# EAGLE design Transceiver Module Dev Board（with MCU）_V1.0 (EAGLE 9.6.2)
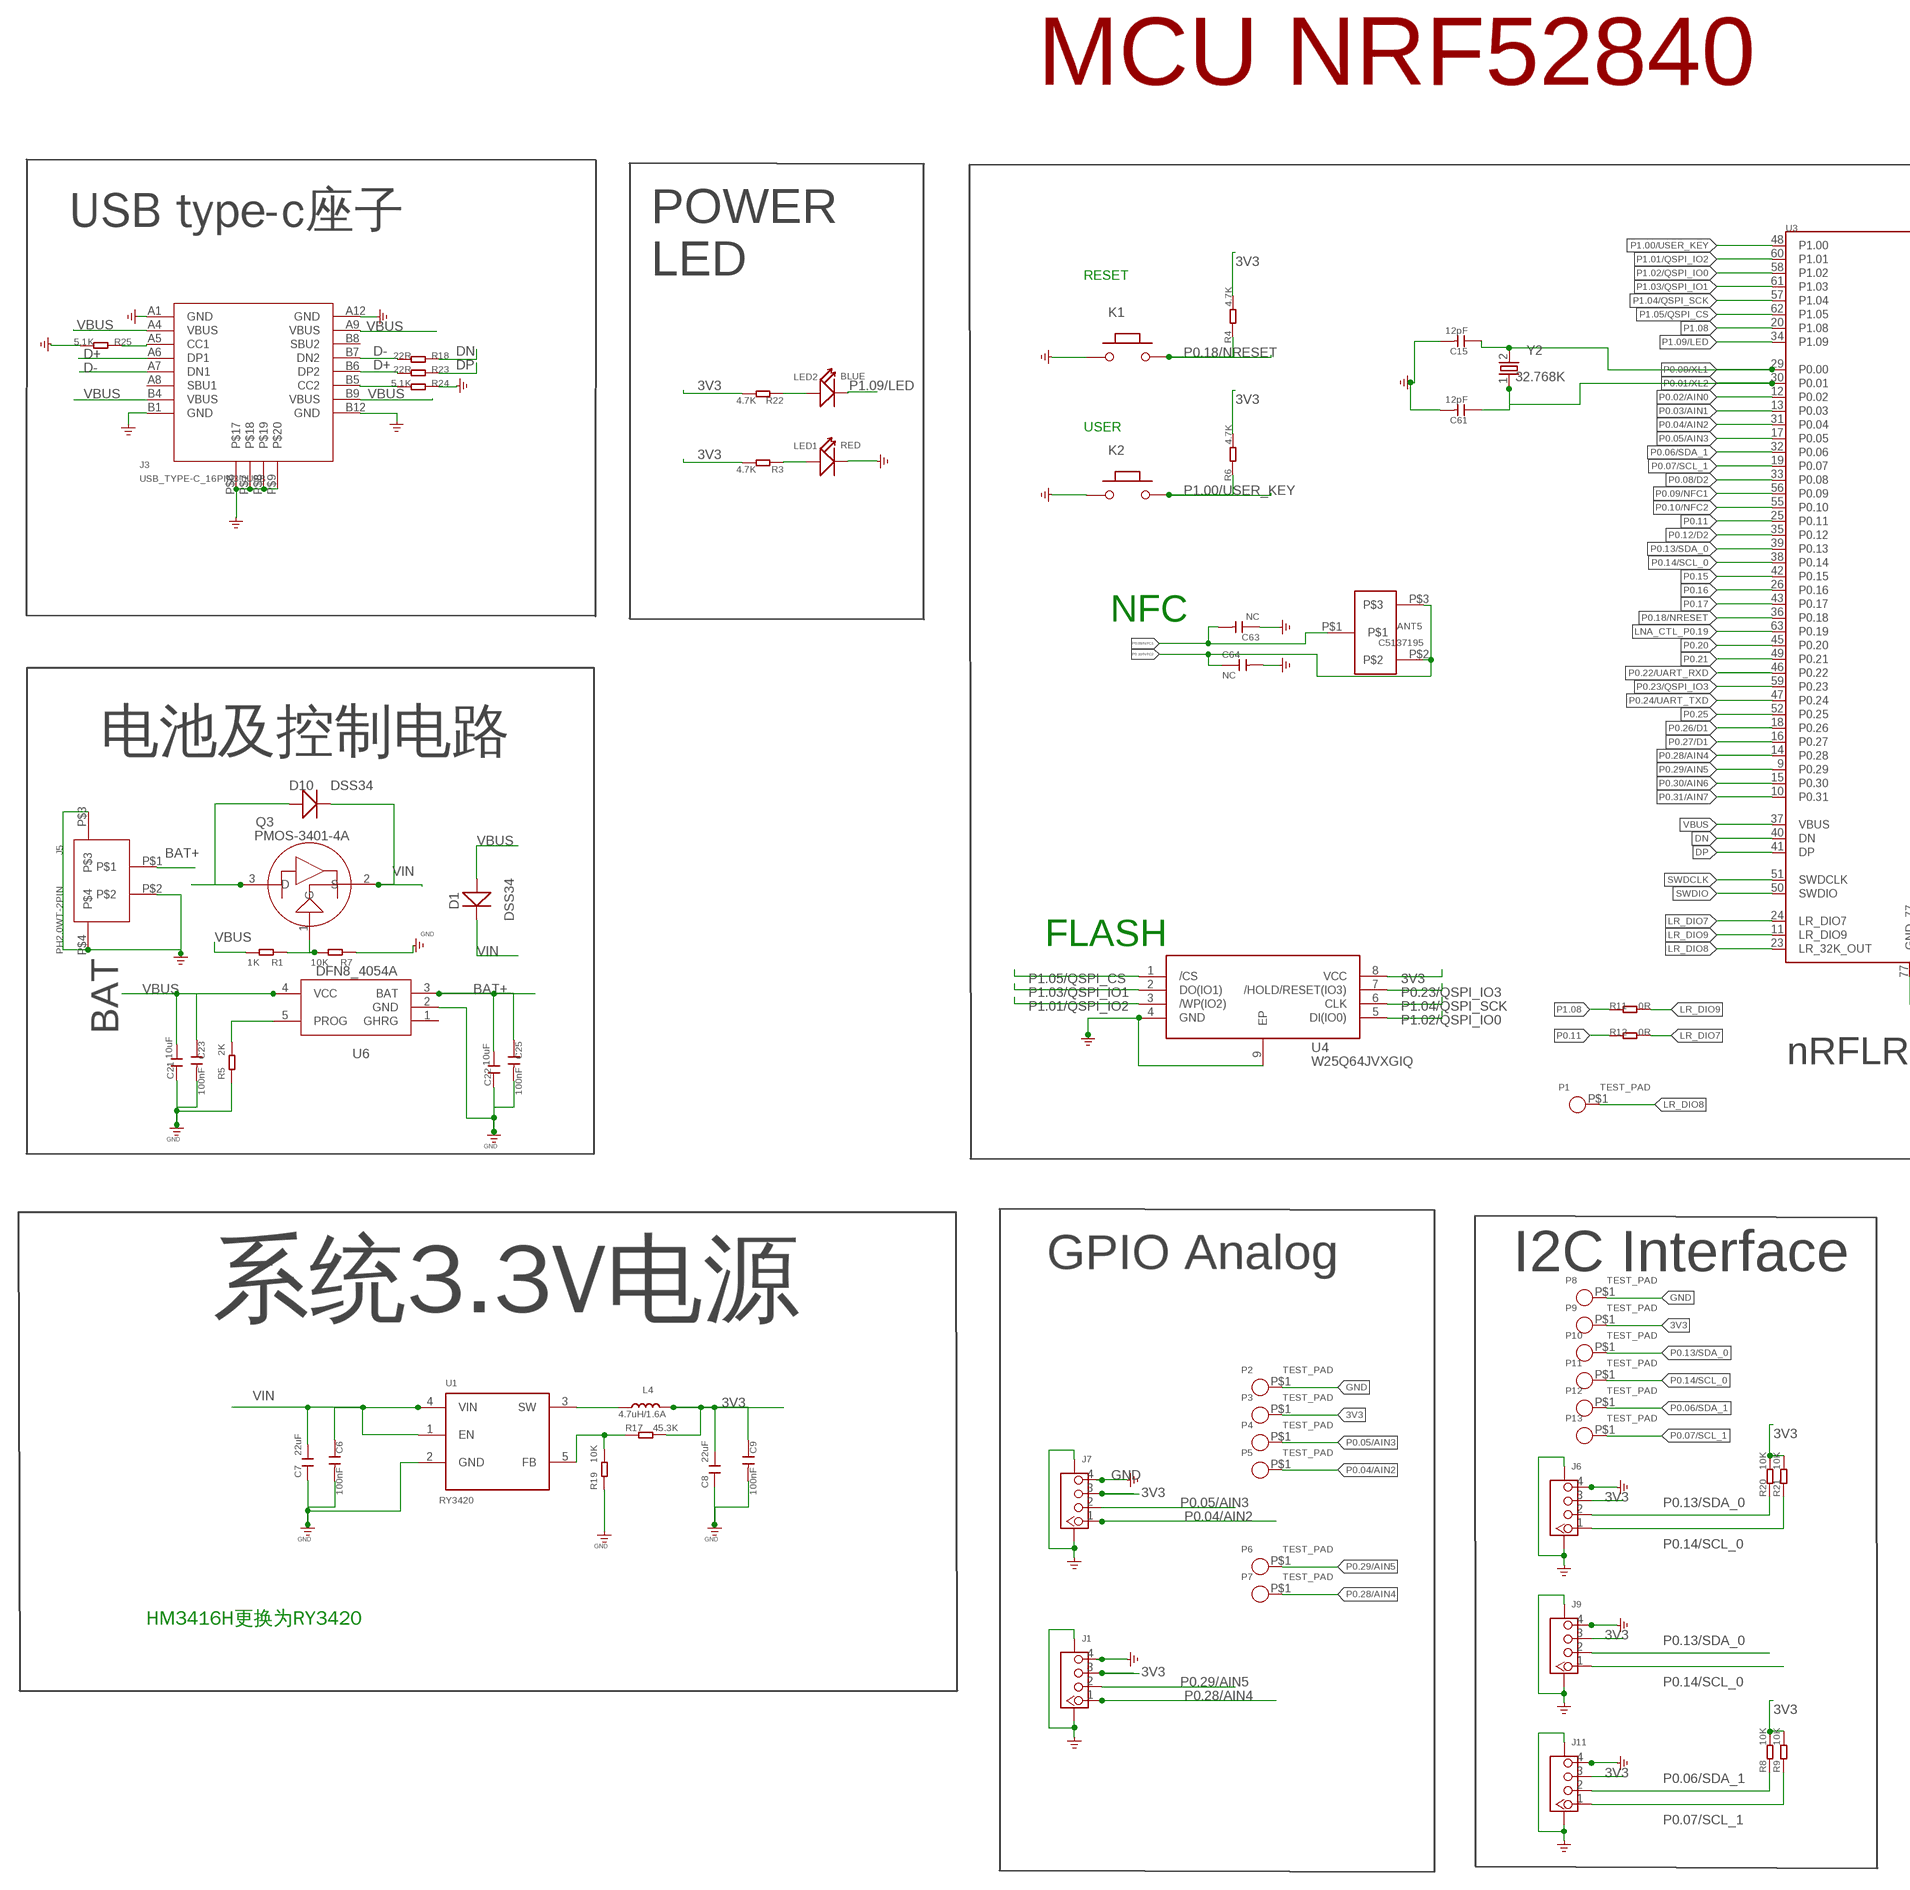
[diagram p0: schematic, sheet 1, part 1 of 2]
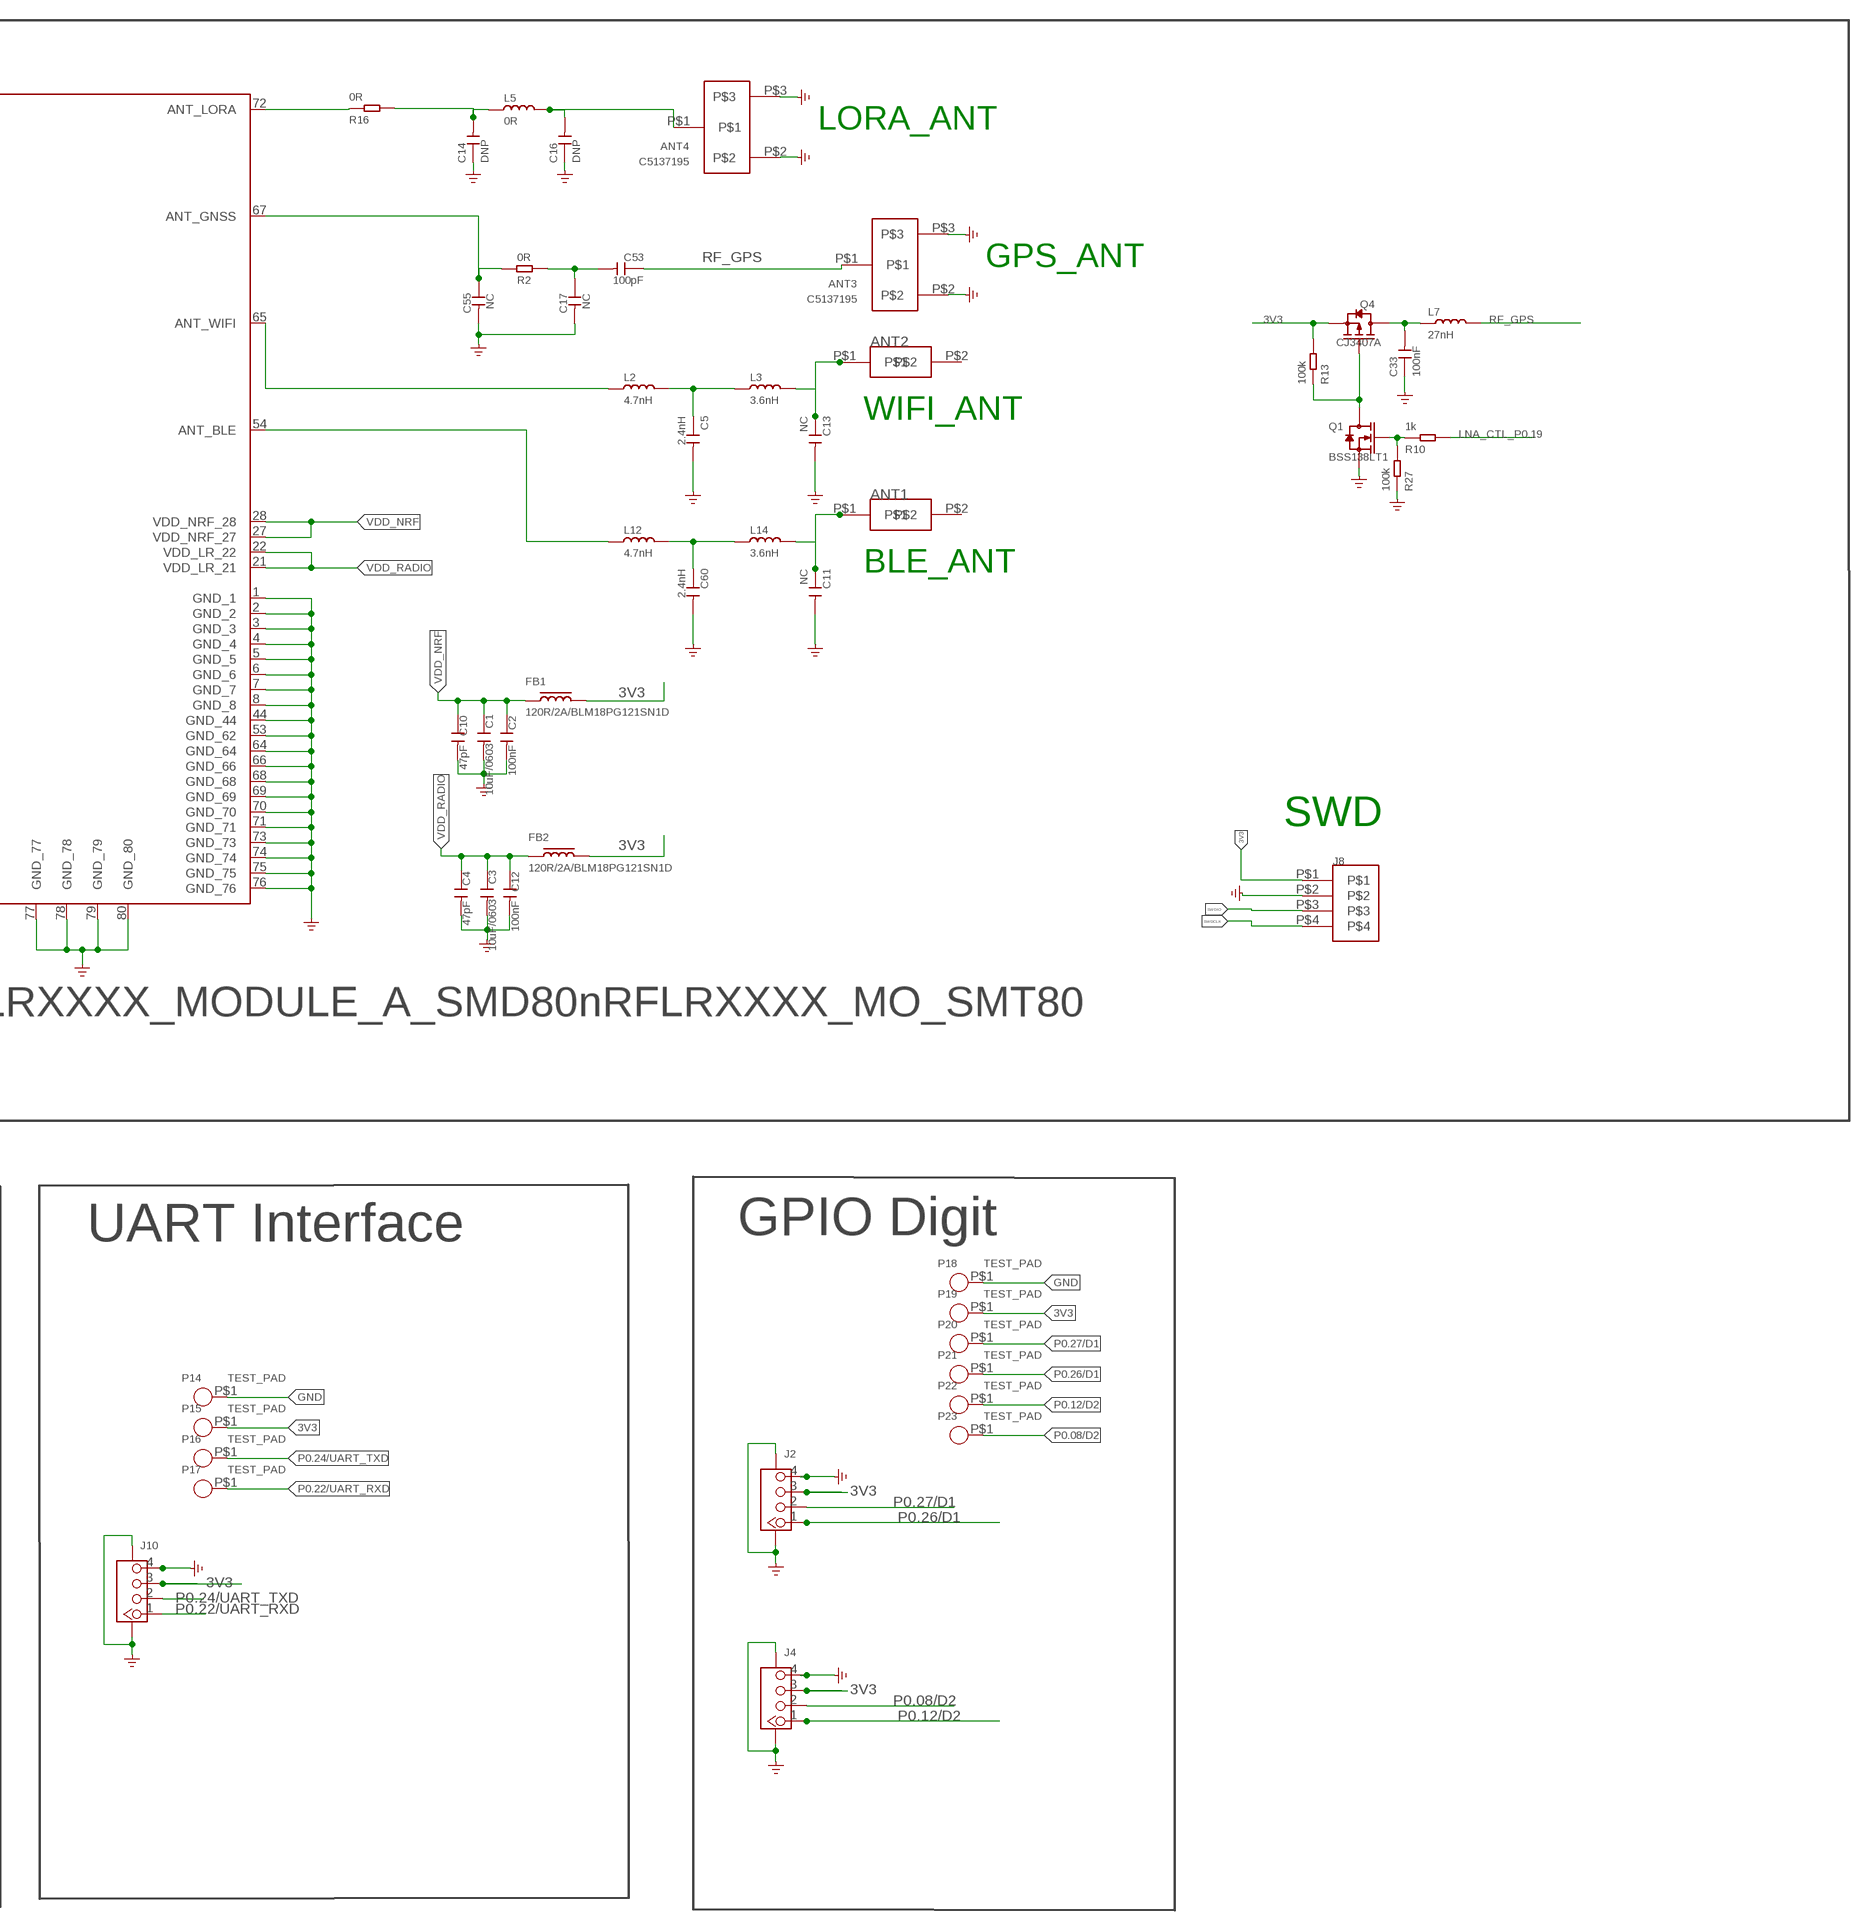
[diagram p1: schematic, sheet 1, part 2 of 2]

## Parts
ANT1  ANT2.4G_BLE  [2.4G_BLE]
ANT2  ANT2.4G_BLE  [2.4G_BLE]
ANT3  C5137195  MYSELF_IPEX  [MYSELF_IPEX1]
ANT4  C5137195  MYSELF_IPEX  [MYSELF_IPEX1]
ANT5  C5137195  MYSELF_IPEX  [MYSELF_IPEX1]
C1  10uF/0603  C0603  [C0603]
C2  100nF  CAPC0402-1  [C0402]
C3  10uF/0603  C0603  [C0603]
C4  47pF  CAPC0402-1  [C0402]
C5  2.4nH  DISCRETE-NEW_CAP-0402  [DISCRETE-NEW_C0402]
C6  100nF  CAPC0402-1  [C0402]
C7  22uF  C0603  [0603]
C8  22uF  C0603  [0603]
C9  100nF  CAPC0402-1  [C0402]
C10  47pF  CAPC0402-1  [C0402]
C11  NC  DISCRETE-NEW_CAP-0402  [DISCRETE-NEW_C0402]
C12  100nF  CAPC0402-1  [C0402]
C13  NC  DISCRETE-NEW_CAP-0402  [DISCRETE-NEW_C0402]
C14  DNP  CAP-0402  [C0402]
C15  12pF  DISCRETE-NEW_CAP-0402  [DISCRETE-NEW_C0402]
C16  DNP  CAP-0402  [C0402]
C17  NC  DISCRETE-NEW_CAP-0402  [DISCRETE-NEW_C0402]
C21  10uF  C0402_W  [0402]
C22  10uF  C0402_W  [0402]
C23  100nF  CAPC0402-1  [C0402]
C25  100nF  CAPC0402-1  [C0402]
C33  100nF  CAP-0402  [C0402]
C53  100pF  DISCRETE-NEW_CAP-0402  [DISCRETE-NEW_C0402]
C55  NC  DISCRETE-NEW_CAP-0402  [DISCRETE-NEW_C0402]
C60  2.4nH  DISCRETE-NEW_CAP-0402  [DISCRETE-NEW_C0402]
C61  12pF  DISCRETE-NEW_CAP-0402  [DISCRETE-NEW_C0402]
C63  NC  DISCRETE-NEW_CAP-0402  [DISCRETE-NEW_C0402]
C64  NC  DISCRETE-NEW_CAP-0402  [DISCRETE-NEW_C0402]
D1  DSS34  DIODE  [D_SOD123FL]
D10  DSS34  DIODE  [D_SOD123FL]
FB1  120R/2A/BLM18PG121SN1D  FBL0603  [L0603]
FB2  120R/2A/BLM18PG121SN1D  FBL0603  [L0603]
J1  CONNECTOR_TWIG-4P-2.0-SMD-FEMALE-REINFORCE90D  [CONNECTOR_4P-SMD-2.0-90D]
J2  CONNECTOR_TWIG-4P-2.0-SMD-FEMALE-REINFORCE90D  [CONNECTOR_4P-SMD-2.0-90D]
J3  USB_TYPE-C_16PIN3.0USB  [KEVIN_3.0TYPEC-SMD]
J4  CONNECTOR_TWIG-4P-2.0-SMD-FEMALE-REINFORCE90D  [CONNECTOR_4P-SMD-2.0-90D]
J5  PH2.0WT-2PIN  [PH2.0WT-2PIN]
J6  CONNECTOR_TWIG-4P-2.0-SMD-FEMALE-REINFORCE90D  [CONNECTOR_4P-SMD-2.0-90D]
J7  CONNECTOR_TWIG-4P-2.0-SMD-FEMALE-REINFORCE90D  [CONNECTOR_4P-SMD-2.0-90D]
J8  2.0MM-4P  [2.0MM-4P]
J9  CONNECTOR_TWIG-4P-2.0-SMD-FEMALE-REINFORCE90D  [CONNECTOR_4P-SMD-2.0-90D]
J10  CONNECTOR_TWIG-4P-2.0-SMD-FEMALE-REINFORCE90D  [CONNECTOR_4P-SMD-2.0-90D]
J11  CONNECTOR_TWIG-4P-2.0-SMD-FEMALE-REINFORCE90D  [CONNECTOR_4P-SMD-2.0-90D]
K1  BUTTON  PB157  [157SW]
K2  BUTTON  PB157  [157SW]
L2  4.7nH  XADOW-GPS-V2_DISCRETE-NEW_INDUCTOR/FERRITE-BEAD0402  [XADOW-GPS-V2_DISCRETE-NEW_L0402]
L3  3.6nH  XADOW-GPS-V2_DISCRETE-NEW_INDUCTOR/FERRITE-BEAD0402  [XADOW-GPS-V2_DISCRETE-NEW_L0402]
L4  4.7uH/1.6A  A9G_DISCRETE_L0805  [A9G_DISCRETE_L0805]
L5  0R  INDUCTOR'0402'  [L0402]
L7  27nH  INDUCTOR'0402'  [L0402]
L12  4.7nH  XADOW-GPS-V2_DISCRETE-NEW_INDUCTOR/FERRITE-BEAD0402  [XADOW-GPS-V2_DISCRETE-NEW_L0402]
L14  3.6nH  XADOW-GPS-V2_DISCRETE-NEW_INDUCTOR/FERRITE-BEAD0402  [XADOW-GPS-V2_DISCRETE-NEW_L0402]
LED1  RED  DISCRETE_LED0603  [DISCRETE_LED-0603]
LED2  BLUE  DISCRETE_LED0603  [DISCRETE_LED-0603]
P1  TEST_PAD  TEST_PADPAD-1.5MM  [TEST_PAD-1.5MM]
P2  TEST_PAD  TEST_PADPAD-1.5MM  [TEST_PAD-1.5MM]
P3  TEST_PAD  TEST_PADPAD-1.5MM  [TEST_PAD-1.5MM]
P4  TEST_PAD  TEST_PADPAD-1.5MM  [TEST_PAD-1.5MM]
P5  TEST_PAD  TEST_PADPAD-1.5MM  [TEST_PAD-1.5MM]
P6  TEST_PAD  TEST_PADPAD-1.5MM  [TEST_PAD-1.5MM]
P7  TEST_PAD  TEST_PADPAD-1.5MM  [TEST_PAD-1.5MM]
P8  TEST_PAD  TEST_PADPAD-1.5MM  [TEST_PAD-1.5MM]
P9  TEST_PAD  TEST_PADPAD-1.5MM  [TEST_PAD-1.5MM]
P10  TEST_PAD  TEST_PADPAD-1.5MM  [TEST_PAD-1.5MM]
P11  TEST_PAD  TEST_PADPAD-1.5MM  [TEST_PAD-1.5MM]
P12  TEST_PAD  TEST_PADPAD-1.5MM  [TEST_PAD-1.5MM]
P13  TEST_PAD  TEST_PADPAD-1.5MM  [TEST_PAD-1.5MM]
P14  TEST_PAD  TEST_PADPAD-1.5MM  [TEST_PAD-1.5MM]
P15  TEST_PAD  TEST_PADPAD-1.5MM  [TEST_PAD-1.5MM]
P16  TEST_PAD  TEST_PADPAD-1.5MM  [TEST_PAD-1.5MM]
P17  TEST_PAD  TEST_PADPAD-1.5MM  [TEST_PAD-1.5MM]
P18  TEST_PAD  TEST_PADPAD-1.5MM  [TEST_PAD-1.5MM]
P19  TEST_PAD  TEST_PADPAD-1.5MM  [TEST_PAD-1.5MM]
P20  TEST_PAD  TEST_PADPAD-1.5MM  [TEST_PAD-1.5MM]
P21  TEST_PAD  TEST_PADPAD-1.5MM  [TEST_PAD-1.5MM]
P22  TEST_PAD  TEST_PADPAD-1.5MM  [TEST_PAD-1.5MM]
P23  TEST_PAD  TEST_PADPAD-1.5MM  [TEST_PAD-1.5MM]
Q1  BSS138LT1  MOSFET-N-SI1304BDL  [SOT-323]
Q3  PMOS-3401-4A  P-MOS-SOT23  [SOT-23]
Q4  CJ3407A  MOSFET-P-SOT323  [SOT-323]
R1  1K  R0402-1  [0402]
R2  0R  DISCRETE-NEW_RES-0402  [DISCRETE-NEW_R0402]
R3  4.7K  R0402-1  [0402]
R4  4.7K  DISCRETE_R-0603  [DISCRETE_R0603]
R5  2K  R0402-1  [0402]
R6  4.7K  DISCRETE_R-0603  [DISCRETE_R0603]
R7  10K  R0402-1  [0402]
R8  10K  R0402-1  [0402]
R9  10K  R0402-1  [0402]
R10  1k  RES-0402  [R0402]
R11  0R  RES-0402  [R0402]
R12  0R  RES-0402  [R0402]
R13  100k  RES-0402  [R0402]
R16  0R  DISCRETE-NEW_RES-0402  [DISCRETE-NEW_R0402]
R17  45.3K  R0402-1  [0402]
R18  22R  R0402-1  [0402]
R19  10K  R0402-1  [0402]
R20  10K  R0402-1  [0402]
R21  10K  R0402-1  [0402]
R22  4.7K  R0402-1  [0402]
R23  22R  R0402-1  [0402]
R24  5.1K  R0402-1  [0402]
R25  5.1K  R0402-1  [0402]
R27  100k  RES-0402  [R0402]
U1  RY3420  CROWBOT_-V1.0-20220525_A_XBJ_HM3420B  [CROWBOT_-V1.0-20220525_A_XBJ_SOT23-5]
U3  nRFLRXXXX_MODULE_A_SMD80nRFLRXXXX_MO_SMT80  LR11XX_MODULE_A_SMD80LR11XX_MO_SMT80  [LR11XX_MO_A_SMD80]
U4  W25Q64JVXGIQ  [XSON-EP(4×4)]
U6  DFN8_4054A  [DFN8_SOP23-5]
Y2  32.768K  NORDIC_NRF_XTAL_32KHZ  [NORDIC_NRF_XTAL_3215_N]

## Nets
3V3: C8.2 C9.1 FB1.2 FB2.2 J1.3 J2.3 J4.3 J6.3 J7.3 J8.P$1 J9.3 J10.3 J11.3 L4.2 P3.P$1 P9.P$1 P15.P$1 P19.P$1 Q4.2(S) R3.2 R4.2 R6.2 R8.2 R9.2 R13.2 R17.2 R20.2 R21.2 R22.2 U4.8(VCC)
BAT+: C22.2 C25.1 D10.+ J5.P$1 Q3.3(D) U6.3(BAT)
D+: J3.A6(DP1) J3.B6(DP2) R23.2
D-: J3.A7(DN1) J3.B7(DN2) R18.2
DN: R18.1 U3.40(DN)
DP: R23.1 U3.41(DP)
GND: ANT3.P$2 ANT3.P$3 ANT4.P$2 ANT4.P$3 C1.2 C2.2 C3.2 C4.2 C5.2 C6.2 C7.1 C8.1 C9.2 C10.2 C11.2 C12.2 C13.2 C14.1 C15.2 C16.1 C17.2 C21.1 C22.1 C23.2 C25.2 C33.1 C55.2 C60.2 C61.2 C63.1 C64.2 J1.4 J1.SS1 J1.SS2 J2.4 J2.SS1 J2.SS2 J3.A1(GND) J3.A12(GND) J3.B1(GND) J3.B12(GND) J3.P$6 J3.P$7 J3.P$8 J3.P$9 J4.4 J4.SS1 J4.SS2 J5.P$2 J5.P$3 J5.P$4 J6.4 J6.SS1 J6.SS2 J7.4 J7.SS1 J7.SS2 J8.P$2 J9.4 J9.SS1 J9.SS2 J10.4 J10.SS1 J10.SS2 J11.4 J11.SS1 J11.SS2 K1.1 K2.1 LED1.- P2.P$1 P8.P$1 P14.P$1 P18.P$1 Q1.2(S) R5.1 R7.1 R19.1 R24.1 R25.2 R27.1 U1.2(GND) U3.1(GND_1) U3.2(GND_2) U3.3(GND_3) U3.4(GND_4) U3.5(GND_5) U3.6(GND_6) U3.7(GND_7) U3.8(GND_8) U3.44(GND_44) U3.53(GND_62) U3.64(GND_64) U3.66(GND_66) U3.68(GND_68) U3.69(GND_69) U3.70(GND_70) U3.71(GND_71) U3.73(GND_73) U3.74(GND_74) U3.75(GND_75) U3.76(GND_76) U3.77(GND_77) U3.78(GND_78) U3.79(GND_79) U3.80(GND_80) U4.4(GND) U4.9(EP) U6.2(GND) ; supply symbol labelled GND_POWER
LNA_CTL_P0.19: R10.2 U3.63(P0.19)
LR_DIO7: R12.2 U3.24(LR_DIO7)
LR_DIO8: P1.P$1 U3.23(LR_32K_OUT)
LR_DIO9: R11.2 U3.11(LR_DIO9)
N$1: LED2.+ R22.1
N$2: L12.1 U3.54(ANT_BLE)
N$3: C5.1 L2.2 L3.1
N$4: ANT2.P$1 C13.1 L3.2
N$5: L2.1 U3.65(ANT_WIFI)
N$6: J3.B5(CC2) R24.2
N$8: C55.1 R2.1 U3.67(ANT_GNSS)
N$9: R16.1 U3.72(ANT_LORA)
N$10: LED1.+ R3.1
N$11: Q3.1(G) R1.1 R7.2
N$12: J3.A5(CC1) R25.1
N$13: L4.1 U1.3(SW)
N$14: C14.2 L5.1 R16.2
N$16: ANT4.P$1 C16.2 L5.2
N$17: Q1.3(D) Q4.1(G) R13.1
N$18: Q1.1(G) R10.1 R27.2
N$20: R17.1 R19.2 U1.5(FB)
N$22: R5.2 U6.5(PROG)
N$27: C33.2 L7.1 Q4.3(D)
N$54: C17.1 C53.2 R2.2
N$63: C60.1 L12.2 L14.1
N$104: ANT1.P$1 C11.1 L14.2
P0.00/XL1: C15.1 U3.29(P0.00) Y2.2
P0.01/XL2: C61.1 U3.30(P0.01) Y2.1
P0.02/AIN0: U3.12(P0.02)
P0.03/AIN1: U3.13(P0.03)
P0.04/AIN2: J7.1 P5.P$1 U3.31(P0.04)
P0.05/AIN3: J7.2 P4.P$1 U3.17(P0.05)
P0.06/SDA_1: J11.2 P12.P$1 R8.1 U3.32(P0.06)
P0.07/SCL_1: J11.1 P13.P$1 R9.1 U3.19(P0.07)
P0.08/D2: J4.2 P23.P$1 U3.33(P0.08)
P0.09/NFC1: ANT5.P$1 C63.2 U3.56(P0.09)
P0.10/NFC2: ANT5.P$2 ANT5.P$3 C64.1 U3.55(P0.10)
P0.11: R12.1 U3.25(P0.11)
P0.12/D2: J4.1 P22.P$1 U3.35(P0.12)
P0.13/SDA_0: J6.2 J9.2 P10.P$1 R20.1 U3.39(P0.13)
P0.14/SCL_0: J6.1 J9.1 P11.P$1 R21.1 U3.38(P0.14)
P0.15: U3.42(P0.15)
P0.16: U3.26(P0.16)
P0.17: U3.43(P0.17)
P0.18/NRESET: K1.2 R4.1 U3.36(P0.18)
P0.20: U3.45(P0.20)
P0.21: U3.49(P0.21)
P0.22/UART_RXD: J10.1 P17.P$1 U3.46(P0.22)
P0.23/QSPI_IO3: U3.59(P0.23) U4.7(/HOLD/RESET(IO3))
P0.24/UART_TXD: J10.2 P16.P$1 U3.47(P0.24)
P0.25: U3.52(P0.25)
P0.26/D1: J2.1 P21.P$1 U3.18(P0.26)
P0.27/D1: J2.2 P20.P$1 U3.16(P0.27)
P0.28/AIN4: J1.1 P7.P$1 U3.14(P0.28)
P0.29/AIN5: J1.2 P6.P$1 U3.9(P0.29)
P0.30/AIN6: U3.15(P0.30)
P0.31/AIN7: U3.10(P0.31)
P1.00/USER_KEY: K2.2 R6.1 U3.48(P1.00)
P1.01/QSPI_IO2: U3.60(P1.01) U4.3(/WP(IO2))
P1.02/QSPI_IO0: U3.58(P1.02) U4.5(DI(IO0))
P1.03/QSPI_IO1: U3.61(P1.03) U4.2(DO(IO1))
P1.04/QSPI_SCK: U3.57(P1.04) U4.6(CLK)
P1.05/QSPI_CS: U3.62(P1.05) U4.1(/CS)
P1.08: R11.1 U3.20(P1.08)
P1.09/LED: LED2.- U3.34(P1.09)
RF_GPS: ANT3.P$1 C53.1 L7.2
SWDCLK: J8.P$4 U3.51(SWDCLK)
SWDIO: J8.P$3 U3.50(SWDIO)
VBUS: C21.2 C23.1 D1.+ J3.A4(VBUS) J3.A9(VBUS) J3.B4(VBUS) J3.B9(VBUS) R1.2 U3.37(VBUS) U6.4(VCC)
VDD_NRF: C1.1 C2.1 C10.1 FB1.1 U3.27(VDD_NRF_27) U3.28(VDD_NRF_28)
VDD_RADIO: C3.1 C4.1 C12.1 FB2.1 U3.21(VDD_LR_21) U3.22(VDD_LR_22)
VIN: C6.1 C7.2 D1.- D10.- Q3.2(S) U1.1(EN) U1.4(VIN)
Unconnected: ANT1.P$2 ANT2.P$2 J3.A8(SBU1) J3.B8(SBU2) U6.1(GHRG)

## Notes on the sheet
- MCU NRF52840
- USB type-c座子
- LORA_ANT
- POWER
  LED
- RESET
- GPS_ANT
- USER
- WIFI_ANT
- NFC
- BLE_ANT
- 电池及控制电路
- SWD
- FLASH
- BAT
- I2C Interface | UART Interface
- 系统3.3V电源 | GPIO Analog | GPIO Digit
- HM3416H更换为RY3420

## Library data of the parts
ANT1 ANT2 = myself:ANT
ANT3-ANT5 = NBIOT:MYSELF_IPEX
C1 C3 = Lora_Basic_Gateway_ Module:C0603
C2 C4 C6 C9 C10 C12 C23 C25 = SX1302_Module:CAP*
C5 C11 C13 C15 C17 C53 C55 C60 C61 C63 C64 = Xadow-GPS-v2:DISCRETE-NEW_CAP: Ceramic Capacitors
C7 C8 = WGH:C0603
C14 C16 C33 = Discrete-new:CAP: Ceramic Capacitors
C21 C22 = WGH:C0402_W
D1 D10 = CrowPanel_Advance_HMI:DIODE*
FB1 FB2 = LoraWAN_Gateway_Mainboard:FB*
J1 J2 J4 J6 J7 J9-J11 = A_xbj:CONNECTOR_TWIG-4P-2.0-SMD-FEMALE-REINFORCE
J3 = WZ3532R024-ESP32-V0.1-20221226:USB_TYPE-C_16PIN
J5 = cooper:PH2.0WT-2PIN
J8 = myself:2.0MM-4P
K1 K2 = MySMD:PB157
L2 L3 L12 L14 = 2401:XADOW-GPS-V2_DISCRETE-NEW_INDUCTOR/FERRITE-BEAD
L4 = ESP32-S3 4.2“ EINK V1.3:A9G_DISCRETE_L*
L5 L7 = Discrete-new:INDUCTOR
LED1 LED2 = A_xbj:DISCRETE_LED*
P1-P23 = A7670X_4G_PCIE:TEST_PAD*
Q1 = Discrete-new:MOSFET-N: IRLL014: http://www.vishay.com/docs/91319/sihll014.pdf
Q3 = DFN8:P-MOS-SOT23
Q4 = Discrete-new:MOSFET-P
R1 R3 R5 R7-R9 R17-R25 = WGH:R0402-1
R2 R16 = Xadow-GPS-v2:DISCRETE-NEW_RES
R4 R6 = Crowtail-_LED-V2.0-20190615-01:DISCRETE_R*
R10 R13 R27 = Discrete-new:RES
R11 R12 = LoraWAN_Gateway_Mainboard:RES*
U1 = CrowPanel ESP32 Display-4.3-inch-V2.1-20240314:CROWBOT_-V1.0-20220525_A_XBJ_HM3420B
U3 = LORA_LR1110:LR11XX_MODULE_A_SMD80
U4 = ESP32-S3 4.2“ EINK V1.3:W25Q64JVXGIQ
U6 = CrowPanel ESP32 Display-4.3-inch-V2.1-20240314:DFN8_4054A
Y2 = nRF52832_MCU:NORDIC_NRF_XTAL_32KHZ

## Net classes
1 50ohm: width 0.156 mm, drill 0.203 mm, clearance 0.469 mm

## Board
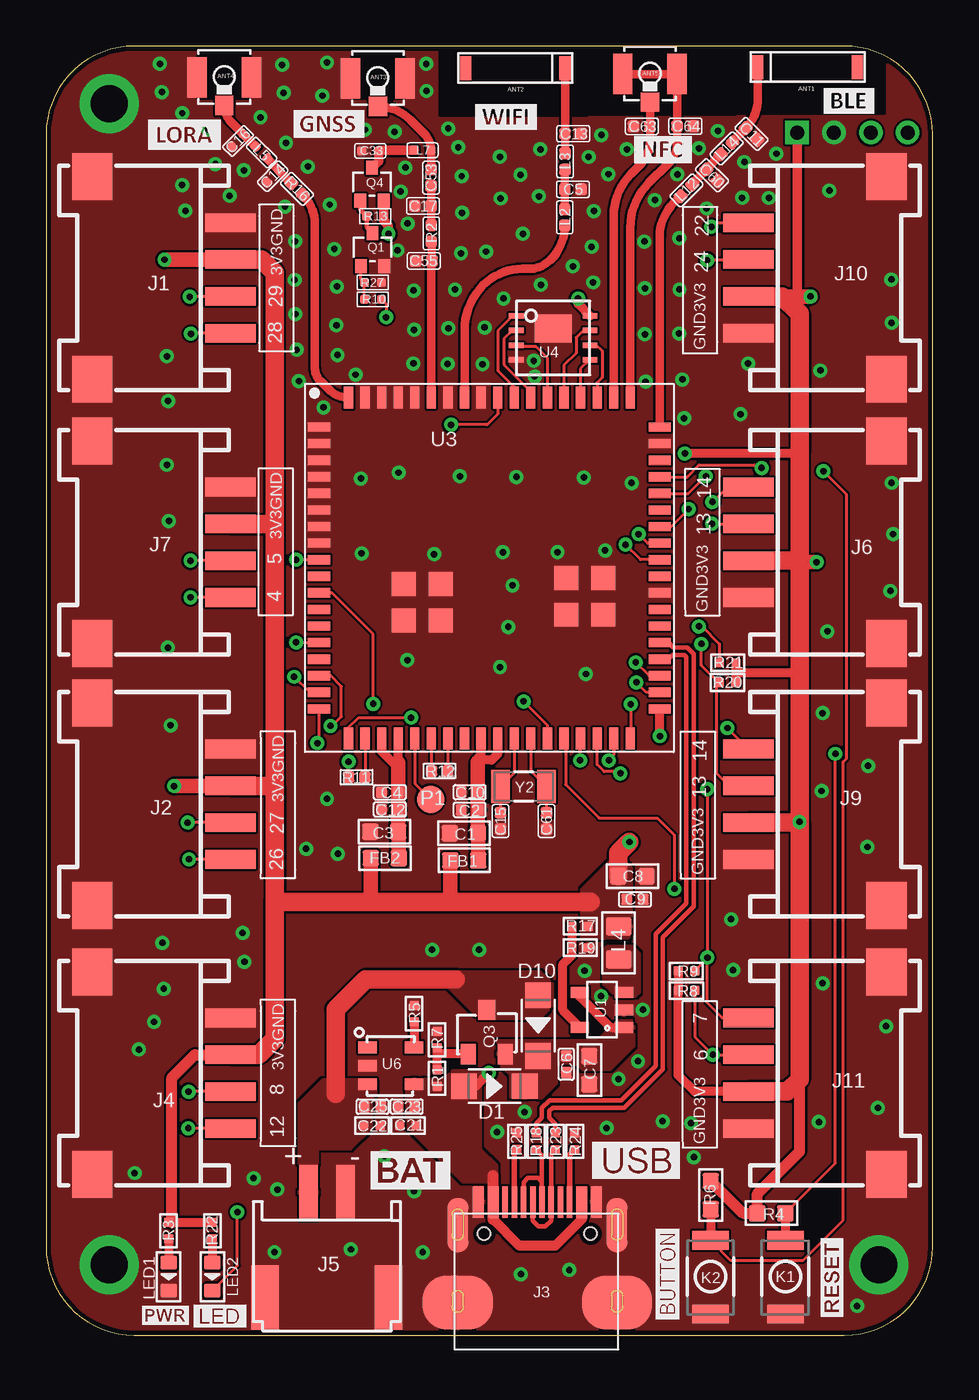
[diagram p2: board, top side]
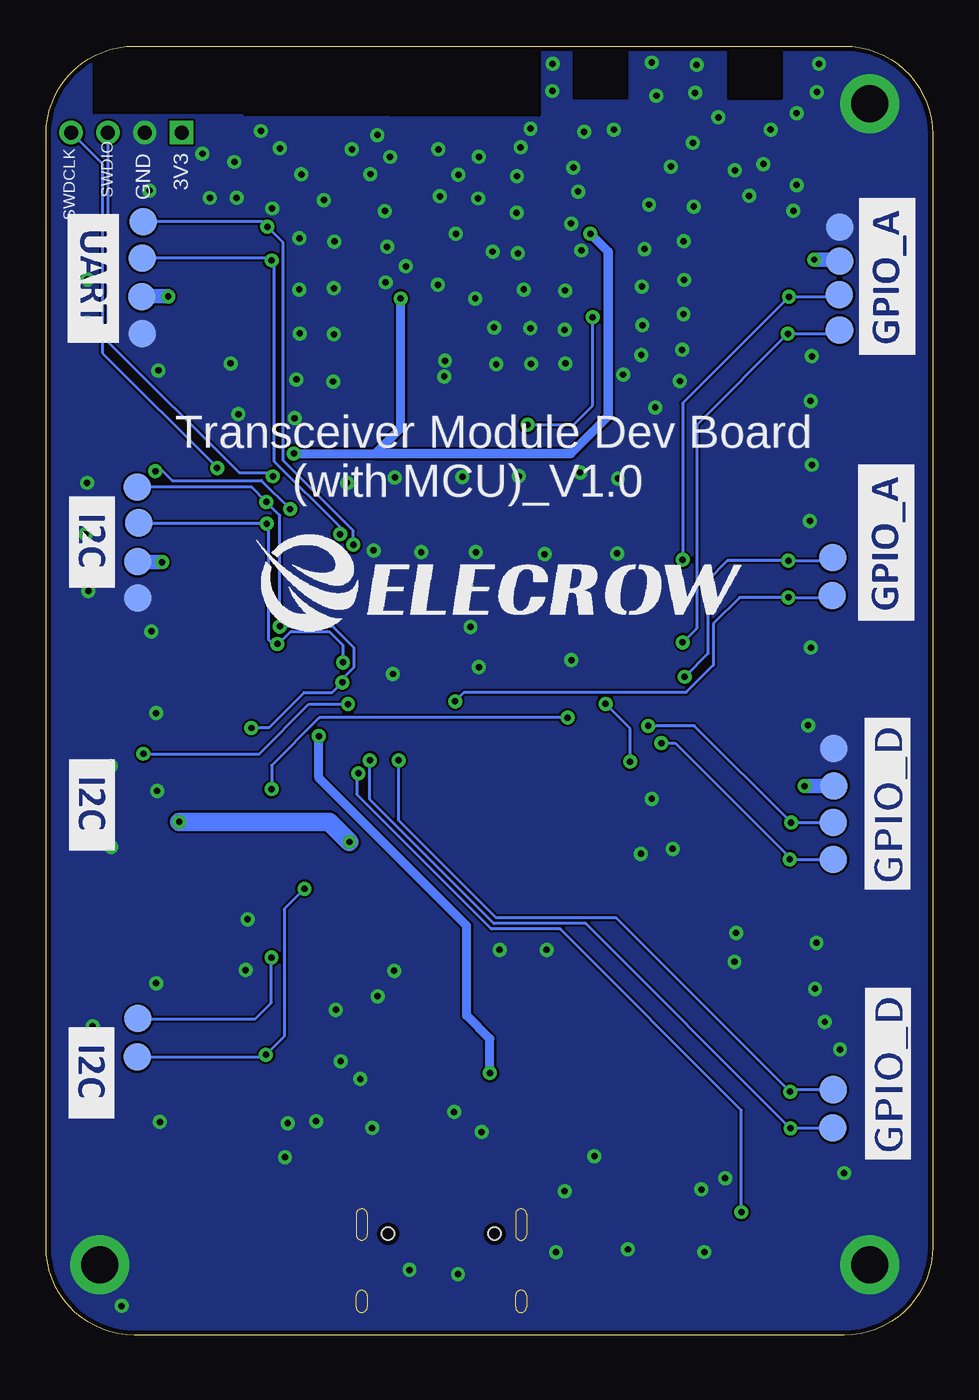
[diagram p3: board, bottom side, seen from below]

Size 48.13 x 70 mm. Coordinates in mm from the lower left corner, seen from the top.
Outline: 48.13,4.8 48.13,65.2 arc90 43.33,70 4.8,70 arc90 0,65.2 0,4.8 arc90 4.8,0 43.33,0 arc90 48.13,4.8
Copper layers (1*16): Top 0.035mm / dielectric 1.5mm / Bottom 0.035mm
Design rules "default *": minimum track width 6mil, minimum drill 0.35mm, track to track 0.12mm, track to pad 6mil, pad to pad 6mil, via to via 6mil, smd to smd 6mil, copper to edge 10mil, drill to drill 6mil, minimum pad ring 10mil, minimum via ring 8mil, stop-mask expansion 4mil, vias tented up to drill 50mil, thermal gap 0mil

### Footprints (pad centres in the part's own frame; a part is rotated, then mirrored left to right if it is on the bottom)
2.4G_BLE = smd 0.6 x 1.3: P$1 0,0; P$2 5.4,0
MYSELF_IPEX1 = smd 1.05 x 1: P$1 0,0 | smd 2.2 x 1.05: P$2 1.525,-1.475; P$3 1.525,1.475
C0603 = smd 0.889 x 0.889: 1 -0.762,0; 2 0.762,0
C0402 = smd 0.6 x 0.6: 1 -0.45,0; 2 0.45,0
DISCRETE-NEW_C0402 = smd 0.635 x 0.635: 1 0,0.445; 2 0,-0.445
0603 = smd 0.889 x 0.889: 1 -0.762,0; 2 0.762,0
C0402' = smd 0.5 x 0.5: 1 -0.463,0; 2 0.463,0
0402 = smd 0.5 x 0.5: 1 -0.45,0; 2 0.45,0
D_SOD123FL = smd 1.397 x 1.397: + -1.651,0; - 1.651,0
L0603 = smd 0.889 x 0.889: 1 -0.762,0; 2 0.762,0
CONNECTOR_4P-SMD-2.0-90D = smd 1.01 x 2.74: 1 -3,-0.1; 2 -1,-0.1; 3 1,-0.1; 4 3,-0.1 | smd 2.54 x 2.184: SS1 -5.5,7.4; SS2 5.5,7.4
KEVIN_3.0TYPEC-SMD = smd 0.3 x 1.7: A1 -3.35,0.5; A4 -2.55,0.5; A5 -1.25,0.5; A6 -0.25,0.5; A7 0.25,0.5; A8 1.25,0.5; A9 2.55,0.5; A12 3.35,0.5; B1 3.05,0.5; B4 2.25,0.5; B5 1.75,0.5; B6 0.75,0.5; B7 -0.75,0.5; B8 -1.75,0.5; B9 -2.25,0.5; B12 -3.05,0.5 | smd 1.143 x 2.921: P$6 -4.318,-0.762; P$7 4.318,-0.762 | smd 3.81 x 2.921: P$8 -4.318,-4.953; P$9 4.318,-4.953 | hole 0.68: -2.89,-1.22; 2.89,-1.22
PH2.0WT-2PIN = smd 1 x 3: P$1 -1,0; P$2 1,0 | smd 1.5 x 3.5: P$3 -3.35,-5.7; P$4 3.35,-5.7
2.0MM-4P = drill 0.762 pad 1.27 square: P$1 0,0 | drill 0.762 pad 1.27: P$2 2,0; P$3 4,0; P$4 6,0
157SW = smd 1.016 x 1.981: 1 0,0; 2 4,0
XADOW-GPS-V2_DISCRETE-NEW_L0402 = smd 0.635 x 0.635: 1 -0.445,0; 2 0.445,0
A9G_DISCRETE_L0805 = smd 1.016 x 1.397: 1 -0.889,0; 2 0.889,0
L0402 = smd 0.5 x 0.5: 1 -0.463,0; 2 0.463,0
DISCRETE_LED-0603 = smd 0.762 x 0.889: + -0.762,0; - 0.762,0
TEST_PAD-1.5MM = smd 1.5 x 1.5: P$1 0,0
SOT-323 = smd 0.762 x 0.635: 1 0.889,-0.635; 2 0.889,0.635; 3 -0.889,0
SOT-23 = smd 1.1 x 0.8: 1 1.2,-1; 2 1.2,1 | smd 1.1 x 0.9: 3 -1.2,0
DISCRETE-NEW_R0402 = smd 0.635 x 0.635: 1 0,0.445; 2 0,-0.445
DISCRETE_R0603 = smd 0.889 x 0.889: 1 -0.762,0; 2 0.762,0
R0402 = smd 0.5 x 0.5: 1 -0.463,0; 2 0.463,0
R0402' = smd 0.635 x 0.635: 1 -0.445,0; 2 0.445,0
CROWBOT_-V1.0-20220525_A_XBJ_SOT23-5 = smd 0.6 x 1: 1 -0.95,-1.2; 2 0,-1.2; 3 0.95,-1.2; 4 0.95,1.2; 5 -0.95,1.2
LR11XX_MO_A_SMD80 = smd 1.2 x 0.5: 1 -9.25,7.65; 2 -9.25,6.75; 3 -9.25,5.85; 4 -9.25,4.95; 5 -9.25,4.05; 6 -9.25,3.15; 7 -9.25,2.25; 8 -9.25,1.35; 9 -9.25,0.45; 10 -9.25,-0.45; 11 -9.25,-1.35; 12 -9.25,-2.25; 13 -9.25,-3.15; 14 -9.25,-4.05; 15 -9.25,-4.95; 16 -9.25,-5.85; 17 -9.25,-6.75; 18 -9.25,-7.65; 37 9.25,-7.65; 38 9.25,-6.75; 39 9.25,-5.85; 40 9.25,-4.95; 41 9.25,-4.05; 42 9.25,-3.15; 43 9.25,-2.25; 44 9.25,-1.35; 45 9.25,-0.45; 46 9.25,0.45; 47 9.25,1.35; 48 9.25,2.25; 49 9.25,3.15; 50 9.25,4.05; 51 9.25,4.95; 52 9.25,5.85; 53 9.25,6.75; 54 9.25,7.65 | smd 0.5 x 1.2: 19 -7.65,-9.25; 20 -6.75,-9.25; 21 -5.85,-9.25; 22 -4.95,-9.25; 23 -4.05,-9.25; 24 -3.15,-9.25; 25 -2.25,-9.25; 26 -1.35,-9.25; 27 -0.45,-9.25; 28 0.45,-9.25; 29 1.35,-9.25; 30 2.25,-9.25; 31 3.15,-9.25; 32 4.05,-9.25; 33 4.95,-9.25; 34 5.85,-9.25; 35 6.75,-9.25; 36 7.65,-9.25; 55 7.65,9.25; 56 6.75,9.25; 57 5.85,9.25; 58 4.95,9.25; 59 4.05,9.25; 60 3.15,9.25; 61 2.25,9.25; 62 1.35,9.25; 63 0.45,9.25; 64 -0.45,9.25; 65 -1.35,9.25; 66 -2.25,9.25; 67 -3.15,9.25; 68 -4.05,9.25; 69 -4.95,9.25; 70 -5.85,9.25; 71 -6.75,9.25; 72 -7.65,9.25 | smd 1.3 x 1.3: 73 -4.64,-0.86; 74 -2.64,-0.86; 75 -4.64,-2.86; 76 -2.64,-2.86; 77 4.18,-0.54; 78 6.18,-0.54; 79 4.18,-2.54; 80 6.18,-2.54
XSON-EP(4×4) = smd 0.8 x 0.3: 1 -2,1.2; 2 -2,0.4; 3 -2,-0.4; 4 -2,-1.2; 5 2,-1.2; 6 2,-0.4; 7 2,0.4; 8 2,1.2 | smd 2 x 1.5: 9 0,0.5
DFN8_SOP23-5 = smd 1 x 0.635: 1 -1.27,1; 2 -1.27,0; 3 -1.27,-1; 4 1.27,-1; 5 1.27,1
NORDIC_NRF_XTAL_3215_N = smd 1 x 1.8: 1 -1.25,0; 2 1.25,0

### Placement (x,y rotation side)
ANT1  38.64,68.86 0 top
ANT2  28.17,68.8 180 top
ANT3  18.01,66.72 90 top
ANT4  9.67,66.78 90 top
ANT5  32.78,66.95 90 top
C1  22.68,27.25 180 top
C2  22.99,28.52 180 top
C3  18.36,27.34 180 top
C4  18.66,29.47 180 top
C5  28.6,62.22 90 top
C6  28.24,14.71 270 top
C7  29.49,14.39 90 top
C8  31.83,24.92 180 top
C9  31.97,23.66 0 top
C10  22.99,29.48 180 top
C11  38.3,65.23 45 top
C12  18.66,28.54 180 top
C13  28.62,65.24 90 top
C14  DNP  [C0402']  12.31,62.93 45 top
C15  24.67,27.92 0 top
C16  DNP  [C0402']  10.42,64.84 45 top
C17  20.46,61.32 270 top
C21  19.65,11.38 0 top
C22  17.69,11.38 180 top
C23  19.57,12.41 180 top
C25  17.72,12.41 0 top
C33  100nF  [C0402']  17.6,64.31 0 top
C53  20.9,62.86 0 top
C55  20.51,58.33 270 top
C60  36.15,62.98 45 top
C61  27.17,27.92 0 top
C63  32.34,65.64 90 top
C64  34.7,65.65 90 top
D1  24.34,13.52 0 top
D10  26.71,16.81 270 top
FB1  22.7,25.78 180 top
FB2  18.39,25.9 180 top
J1  9.91,57.4 90 top
J2  9.91,28.83 90 top
J3  26.67,6.73 0 top
J4  9.91,14.22 90 top
J5  15.24,7.75 0 top
J6  38.22,43.05 270 top
J7  9.91,43.05 90 top
J8  40.77,65.3 0 top
J9  38.22,28.83 270 top
J10  38.22,57.4 270 top
J11  38.22,14.22 270 top
K1  40.13,1.14 90 top
K2  36.07,1.14 90 top
L2  28.16,60.7 90 top
L3  28.18,63.73 90 top
L4  31.08,21.3 90 top
L5  11.7,64.22 135 top
L7  20.44,64.34 0 top
L12  34.76,62.16 45 top
L14  36.94,64.44 45 top
LED1  6.66,3.17 270 top
LED2  9.03,3.17 270 top
P1  20.88,29.09 0 top
P2  5.05,60.16 0 bottom
P3  5.05,58.32 0 bottom
P4  5.44,42.21 0 bottom
P5  5.46,40.15 0 bottom
P6  5.07,56.49 0 bottom
P7  5.06,54.57 0 bottom
P8  43.14,40.02 0 bottom
P9  43.14,42 0 bottom
P10  43.1,44.11 0 bottom
P11  43.19,46.04 0 bottom
P12  43.18,15.11 0 bottom
P13  43.14,17.19 0 bottom
P14  42.91,54.39 0 bottom
P15  42.93,56.38 0 bottom
P16  42.91,58.49 0 bottom
P17  42.86,60.46 0 bottom
P18  5.37,31.85 0 bottom
P19  5.37,29.82 0 bottom
P20  5.4,27.85 0 bottom
P21  5.39,25.84 0 bottom
P22  5.42,11.26 0 bottom
P23  5.4,13.33 0 bottom
Q1  17.72,58.95 270 top
Q3  23.92,16.46 270 top
Q4  17.69,62.5 270 top
R1  21.23,13.95 270 top
R2  20.91,59.83 180 top
R3  6.66,5.67 90 top
R4  39.37,6.62 180 top
R5  19.98,17.46 270 top
R6  36.08,7.6 90 top
R7  21.23,16.04 270 top
R8  34.76,18.71 180 top
R9  34.76,19.77 180 top
R10  17.74,56.25 0 top
R11  0R  [R0402']  16.86,30.29 180 top
R12  0R  [R0402']  21.36,30.63 180 top
R13  17.86,60.76 0 top
R16  13.62,62.24 225 top
R17  28.99,22.2 0 top
R18  26.61,10.52 270 top
R19  28.99,21.04 180 top
R20  36.99,35.44 0 top
R21  37,36.51 0 top
R22  9.03,5.67 90 top
R23  27.65,10.52 270 top
R24  28.7,10.52 270 top
R25  25.55,10.53 90 top
R27  17.74,57.17 180 top
U1  30.17,17.67 90 top
U3  24.07,41.66 0 top
U4  27.53,54.16 0 top
U6  18.71,14.63 0 top
Y2  25.92,29.79 180 top

### Tracks (layer width: path | path; a pad name or v marks a point on that pad's centre or on a via)
3V3  (via drill 0.35)
  Top 0.5: R3.2 6.83,6.12 R22.2 | J11.3 35.21,13.22 34.31,14.12 R8.2 R9.2 | U4.8 28.88,56 v28.88,56.29 | R21.2 37.45,35.94 | 37.45,35.94 R20.2 | 37.45,35.94 37.5,35.99 40.9,35.99 | 40.9,47.92 40.86,47.88 v34.67,47.88
  Top 0.508: J8.P$1 40.77,56.4 40.54,56.4 | v18.59,59.8 18.59,60.25 18.32,60.51 R13.2 Q4.2
  Top 0.6: 6.83,6.12 6.83,13.97 8.08,15.22 J4.3 | R6.2 37.82,6.62 R4.2 38.61,7.68 40.9,9.97 40.9,13.89
  Top 0.8: FB2.2 17.63,23.54 17.61,23.52 | FB1.2 21.94,23.57 21.99,23.52 | J1.3 v6.43,58.4 | J2.3 6.97,29.83 v6.95,29.81 | 40.9,41.98 v41.82,41.98 v41.83,41.97 | J10.3 40.54,56.4 v41.49,56.4 v41.5,56.4
  Top 1: J4.3 11.54,15.22 12.41,16.09 12.41,23.53 | 12.41,29.79 12.41,23.53 | 12.41,29.79 12.41,44.01 | 12.41,44.01 12.41,57.69 11.7,58.4 J1.3 | J7.3 12.37,44.05 12.41,44.01 | J2.3 12.37,29.83 12.41,29.79 | 12.41,23.53 12.42,23.52 17.61,23.52 21.99,23.52 29.57,23.52 | C8.2 31.07,26.19 v31.66,26.78 | v40.9,27.87 40.9,13.89 40.23,13.22 J11.3 | v40.9,27.87 40.9,35.99 40.9,41.98 | 40.9,41.98 40.9,47.92 40.9,55.46 39.96,56.4 J10.3 | J9.3 40.86,27.83 v40.9,27.87 | J6.3 40.83,42.05 40.9,41.98
  Bottom 0.5: v34.67,47.88 30.25,47.88 28.88,49.25 v28.88,56.29
  Bottom 0.508: 30.25,47.88 19.65,47.88 17.61,49.92 17.61,58.82 v18.59,59.8
  Bottom 0.8: v6.43,58.4 5.13,58.4 P3.P$1 | v6.95,29.81 5.38,29.81 P19.P$1 | v41.83,41.97 v41.84,41.98 43.12,41.98 P9.P$1 | P15.P$1 42.9,56.41 v41.5,56.41 v41.5,56.4
  Bottom 1: v31.66,26.78 32.75,27.87 v40.9,27.87
  pour Top: 31.79,21.72 31.79,25.38 31.48,25.69 30.55,25.69 29.05,24.19 29.05,21.57 31.64,21.57
BAT+
  Top 1: 22.25,19.33 17.36,19.33 15.72,17.69 15.72,13.1
  pour Top: 13.75,6.3 13.75,12.61 15.02,13.88 17.91,13.88 17.91,13.09 17.64,12.82 17.64,11.2 16.52,10.08 14.71,10.08 14.71,6.3
  pour Top: 27.46,17.84 26.8,17.18 23.53,17.18 21.8,18.91 21.54,18.91 21.54,19.76 26.82,19.76 27.46,19.11
D+
  Top 0.254: J3.A6 26.42,6.2 26.72,5.9 27.1,5.9 27.42,6.22 J3.B6 27.42,9.84 R23.2
D-
  Top 0.254: J3.B7 25.92,8.3 26.15,8.53 26.72,8.53 26.92,8.33 | 26.92,8.33 J3.A7 | 26.92,8.33 26.92,9.76 R18.2
DN
  Top 0.254: R18.1 26.61,11.5 26.9,11.79 26.9,12.33 27.33,12.76 31.23,12.76 33.09,14.62 33.09,21.78 34.76,23.45 34.76,36.82 34.64,36.94 34.02,36.94 33.78,36.71 U3.40
DP
  Top 0.254: R23.1 27.65,11.46 27.32,11.79 27.32,12.18 27.5,12.35 31.4,12.35 33.48,14.44 33.48,21.6 35.17,23.29 35.17,36.98 34.81,37.34 34.06,37.34 33.79,37.61 U3.41
GND  (via drill 0.35, 2 pad 3.2)
  other vias: 10.67,21.84 10.76,20.27 26.47,52.91 26.52,52.06 7.39,66.35 9.19,63.59 15,67.3 7.56,61.05 8.8,65.46 10.74,63.25 13.02,64.74 7.38,62.45 15.79,56.94 11.64,66.12 15.82,53.22 12.89,67.46 15.4,61.39 15.64,58.97 14.22,63.46 13.52,59.4 13.53,55.44 13.5,57.3 13.61,53.5 15.06,50.37 19.14,46.84 13.73,51.81 19.63,60.36 19.25,62.1 19.08,58.9 19.96,56.73 16.8,52.16 19.98,54.59 15.76,54.84 19.94,52.76 17.3,65.46 18.92,65.34 19.5,63.4 21.8,52.74 22.57,62.93 23.89,58.83 30.52,63.04 25.88,59.81 22.52,58.75 22.58,60.95 25.75,63.01 26.83,64.39 26.75,61.84 22.2,56.78 21.84,54.67 23.69,52.72 23.81,54.71 29.7,57.16 24.83,56.29 28.6,58.04 37.69,50 42.52,62.15 36.47,65.39 35.44,64.45 24.68,61.73 32.51,56.85 32.51,54.35 32.55,51.78 34.64,49.79 34.36,54.39 34.54,51.9 34.39,56.78 32.48,59.39 34.38,59.56 35.86,61.18 37.78,61.76 37.91,63.71 39.65,64.16 39.24,61.75 45.88,57.32 45.9,54.97 38.11,52.76 42.03,52.38 6.56,53.16 6.63,50.73 6.56,47.26 6.67,44.21 6.61,37.33 6.76,33.11 6.31,21.3 6.39,18.81 5.86,17.01 5.03,15.51 4.81,8.8 20.45,4.51 12.55,7.91 12.4,4.51 11.27,8.52 16.55,4.66 18.36,9.71 19.98,7.82 25.77,3.31 28.4,3.54 33.47,11.61 30.43,11.25 35.01,11.51 35.16,9.66 44.03,1.59 41.95,11.57 45.15,12.34 45.6,16.77 42.15,19.11 20.96,20.92 23.51,20.92 37.3,19.83 37.19,22.58 15.84,26.14 14.12,26.41 15.25,29.12 44.58,26.51 42.1,29.55 44.62,30.91 42.15,33.78 42.41,38.21 45.83,40.41 45.98,43.5 45.9,46.28 24.64,36.27 19.61,36.65 29.3,35.9 25.09,38.46 17.13,42.45 21.07,42.4 25.32,40.71 24.8,42.51 27.76,42.52 30.35,42.61 17.08,46.52 22.46,46.64 25.53,46.61 29.19,46.58 31.78,46.27 30.15,65.17 29.46,63.98 31.53,64.39 29.73,61.04 26.86,57.04 29.62,59.1 33.05,61.63 34.27,63.03 24.64,63.98 9.97,61.87 6.17,69.03 6.28,67.49 12.97,61.29 12.81,68.97 15.25,69.11 20.64,69.04 20.65,67.56 21.83,65.51 22.37,64.5 25.98,12.12 24.48,11.03 29.24,19.78 30.13,18.4 32.4,17.67 32.13,14.87 31.07,13.91 3.43,66.87 3.43,3.81 45.21,3.81
  pour Top (rank 2): -6.51,72.28 -6.51,-3.76 50.66,-3.76 50.66,72.28
  pour Bottom (rank 2): -6.49,72.45 -6.49,-3.73 50.73,-3.73 50.73,72.45
  cutout Top: 21.37,70.14 21.37,66.25 29.38,66.25 29.38,70.17 21.36,70.17 21.36,70.13
  cutout Bottom: 29.37,70.16 29.37,66.27 37.34,66.27 37.34,70.16
GND1
  cutout Bottom: 37.33,70.15 37.33,66.38 45.53,66.38 45.53,70.17 37.32,70.17
GND2
  cutout Top: 37.3,70.17 37.3,66.34 45.53,66.34 45.53,70.17
GND3
  cutout Bottom: 21.36,70.17 21.36,66.24 29.38,66.24 29.38,70.17
GND4
  cutout Top: 29.32,70.14 29.32,66.3 37.45,66.3 37.45,70.14
GND5
  cutout Bottom: 8.23,69.98 8.23,67.15 11.08,67.15 11.08,69.98
GND6
  cutout Top: 8.23,70 8.23,67.16 11.08,67.16 11.08,70
GND8
  cutout Bottom: 16.6,69.99 16.6,67.16 19.45,67.16 19.45,69.99
GND9
  cutout Top: 16.6,70 16.6,67.16 19.45,67.16 19.45,70
LNA_CTL_P0.19  (via drill 0.35)
  Top 0.152: U3.63 24.52,50.02 23.94,49.44 v21.99,49.44 | R10.2 18.46,56 v18.46,55.27
  Bottom 0.152: v21.99,49.44 19.49,49.44 18.46,50.48 v18.46,55.27
LR_DIO7
  Top 0.152: U3.24 R12.2
LR_DIO8
  Top 0.152: U3.23 20.02,29.95 P1.P$1
LR_DIO9  (via drill 0.35)
  Top 0.152: R11.2 v16.42,31.14 | v17.76,34.28 17.76,38.07 15.52,40.31 U3.11
  Bottom 0.152: v16.42,31.14 16.42,32.94 v17.76,34.28
N$1
  Top 0.5: R22.1 LED2.+
N$2
  Top 0.463: U3.54 33.31,59.66 arc-45 34.06,61.46 L12.1
N$3
  Top 0.156: C5.1 arc45 C5.1 | 28.15,63.23 arc-45 L3.1
  Top 0.463: L2.2 C5.1 | C5.1 28.15,63.23
N$4
  Top 0.156: C13.1 arc45 C13.1
  Top 0.463: L3.2 C13.1 | ANT2.P$1 C13.1
N$5
  Top 0.463: L2.1 arc-45 27.39,58.41 27.37,58.38 arc-45 26.2,57.9 25.84,57.9 arc45 23.75,57.03 arc45 22.71,54.54 U3.65
N$6
  Top 0.3: R24.2 28.42,9.79 J3.B5
N$8
  Top 0.152: 20.93,59.32 arc-45 R2.1
  Top 0.463: 20.93,59.32 20.93,58.35 | C55.1 20.93,58.35 | U3.67 20.91,58.3 arc-45 20.93,58.35
N$9
  Top 0.463: U3.72 arc-45 15.36,51.34 14.9,51.8 arc-45 14.59,52.57 14.59,60.37 arc45 R16.1
N$10
  Top 0.5: R3.1 LED1.+
N$11
  Top 0.5: R1.1 21.23,15.28 | 21.23,15.28 R7.2 | Q3.1 21.25,15.26 21.23,15.28
N$12
  Top 0.3: R25.1 25.42,9.95 J3.A5
N$13
  pour Top: 30.24,20.9 30.24,19.07 30.9,18.41 32.02,18.41 32.22,18.61 32.22,20.73 31.85,21.1 30.44,21.1
N$14
  Top 0.463: R16.2 12.65,63.22 arc-45 C14.2 12.05,63.84 arc-45 L5.1
N$16
  Top 0.463: L5.2 C16.2 arc45 C16.2 10.05,65.86 arc-45 ANT4.P$1
N$17
  Top 0.254: Q1.3 17.4,60.16 R13.1 17.06,61.1 Q4.1
N$18
  Top 0.152: R10.1 R27.2 17.09,57.35 Q1.1
N$20
  Top 0.5: R17.1 R19.2 28.54,20.63 28.05,20.14 28.05,17.64 U1.5
N$22
  Top 0.5: R5.2 U6.5
N$27
  Top 0.508: Q4.3 18.07,63.76 C33.2 18.09,64.34 L7.1
N$54
  Top 0.463: R2.2 C17.1 C53.2
N$63
  Top 0.156: 35.86,63.35 arc45 C60.1 | 35.12,62.58 arc45 L12.2
  Top 0.463: L14.1 35.86,63.35 | C60.1 35.12,62.58
N$104
  Top 0.156: L14.2 arc-45 37.31,64.87
  Top 0.463: 37.31,64.87 C11.1 arc45 38.64,67.13 ANT1.P$1
P0.00/XL1
  Top 0.152: U3.29 25.41,30.54 24.75,29.88 Y2.2 C15.1
P0.01/XL2
  Top 0.152: U3.30 26.32,30.64 27.07,29.89 Y2.1 C61.1
P0.04/AIN2  (via drill 0.35)
  Top 0.152: J7.1 v7.85,40.05 v7.84,40.06 | v25.92,34.42 27.21,33.12 U3.31
  Bottom 0.152: v25.92,34.42 25.42,34.92 13.37,34.92 11.9,36.38 11.9,38.64 10.48,40.06 v7.84,40.06 5.55,40.06 P5.P$1
P0.05/AIN3  (via drill 0.35)
  Top 0.152: J7.2 v7.84,42.05 | U3.17 14.31,34.91 v13.47,35.75
  Bottom 0.152: v13.47,35.75 12.21,37.01 12.21,40.98 11.14,42.05 v7.84,42.05 5.6,42.05 P4.P$1
P0.06/SDA_1  (via drill 0.35)
  Top 0.152: R8.1 35.21,16.21 v36.2,15.22 J11.2 | U3.32 28.2,32.32 28.2,29.89 30.02,28.07 33.18,28.07 34.1,27.15 v34.1,24.24
  Bottom 0.152: v34.1,24.24 35.21,23.13 35.21,16.21 v36.2,15.22 36.31,15.11 P12.P$1
P0.07/SCL_1  (via drill 0.35)
  Top 0.152: R9.1 35.89,20.45 v35.89,20.5 | v35.89,20.5 35.89,18.03 36.7,17.22 J11.1 | U3.19 16.41,32.98 16.97,33.54 v19.82,33.54 | v35.89,29.65 v35.89,20.5
  Bottom 0.152: v19.82,33.54 33.29,33.54 35.89,30.94 v35.89,29.65 | P13.P$1 43.13,17.18 36.77,17.18 35.89,18.05 v35.89,20.5
P0.08/D2  (via drill 0.35)
  Top 0.152: J4.2 v7.74,13.22 | v28.99,31.21 28.99,32.38 U3.33
  Bottom 0.152: v7.74,13.22 v7.75,13.23 7.85,13.33 | 7.85,13.33 17.18,22.66 23.7,22.66 28.99,27.95 v28.99,31.21 | P23.P$1 7.85,13.33
P0.09/NFC1
  Top 0.156: 32.78,66.94 arc45 ANT5.P$1
  Top 0.463: U3.56 30.82,60.78 arc-45 31.75,63.04 32.23,63.52 arc45 32.78,64.86 C63.2 32.78,66.94
P0.10/NFC2
  Top 0.156: ANT5.P$2 arc45 ANT5.P$2
  Top 0.463: U3.55 31.71,60.13 arc-45 32.72,62.57 33.78,63.62 arc45 34.26,64.78 C64.1 ANT5.P$2 | ANT5.P$2 ANT5.P$3
P0.11
  Top 0.152: U3.25 21.82,30.64 R12.1
P0.12/D2  (via drill 0.35)
  Top 0.152: J4.1 7.74,11.22 v7.72,11.24 | U3.35 30.82,31.52 30.55,31.25 v30.55,31.21
  Bottom 0.152: v30.55,31.21 30.55,29.08 23.83,22.36 18.84,22.36 v7.72,11.24 7.71,11.26 P22.P$1
P0.13/SDA_0  (via drill 0.35)
  Top 0.152: U3.39 32.73,35.81 v32.01,36.53 | v36.15,44.06 v36.16,44.05 J6.2 | v35.57,37.53 35.57,36.37 36.51,35.44 R20.1 36.38,35.28 36.38,30.54 37.09,29.83 J9.2
  Bottom 0.152: v32.01,36.53 32.01,37.45 32.73,38.17 34.88,38.17 35.57,37.48 v35.57,37.53 35.81,37.53 36.06,37.77 36.06,43.97 v36.15,44.06 43.05,44.06 P10.P$1
P0.14/SCL_0  (via drill 0.35)
  Top 0.152: U3.38 32.58,34.91 v32.04,35.45 | v36.17,45.24 v36.18,45.24 36.99,46.05 J6.1 | v35.44,38.48 35.61,38.48 36.55,37.54 R21.1 | v36.99,32.97 J9.1
  Bottom 0.152: P11.P$1 36.98,46.05 v36.17,45.24 35.44,44.51 v35.44,38.48 32.56,38.48 31.4,37.32 31.4,36.28 32.04,35.64 v32.04,35.45 32.59,34.9 34.12,34.9 36.05,32.97 v36.99,32.97
P0.18/NRESET  (via drill 0.35)
  Top 0.152: R4.1 42.85,9.34 v42.85,31.57 | v31.74,34.26 31.74,32.43 U3.36
  Top 0.5: R4.1 K1.2
  Bottom 0.152: v42.85,31.57 36.55,31.57 33.86,34.26 v31.74,34.26
P0.22/UART_RXD  (via drill 0.35)
  Top 0.152: U3.46 32.27,42.11 v31.45,42.92 | v36.12,60.18 36.34,60.4 J10.1
  Bottom 0.152: v31.45,42.92 31.45,43.68 35.28,47.51 35.28,59.34 v36.12,60.18 36.4,60.45 P17.P$1
P0.23/QSPI_IO3
  Top 0.152: U4.7 29.16,54.56 28.78,54.17 28.78,53.34 28.11,52.67 U3.59
P0.24/UART_TXD  (via drill 0.35)
  Top 0.152: U3.47 32.65,43.01 v32.17,43.49 | v35.89,58.36 35.93,58.4 J10.2
  Bottom 0.152: v32.17,43.49 32.17,43.87 35.77,47.47 35.77,58.24 v35.89,58.36 36.02,58.48 P16.P$1
P0.26/D1  (via drill 0.35)
  Top 0.152: J2.1 v7.77,25.83 v7.76,25.84 | U3.18 14.81,32.23 v14.73,32.15
  Bottom 0.152: v14.73,32.15 13.98,32.15 7.76,25.93 v7.76,25.84 v7.75,25.84 P21.P$1
P0.27/D1  (via drill 0.35)
  Top 0.152: J2.2 v7.69,27.83 | U3.16 15.45,35.81 16.03,35.23 16.03,33.59 15.52,33.08 v15.44,33.08
  Bottom 0.152: v15.44,33.08 12.94,33.08 v7.69,27.83 7.67,27.84 P20.P$1
P0.28/AIN4  (via drill 0.35)
  Top 0.152: J1.1 7.88,54.4 v7.86,54.38 | v13.57,37.62 14.8,37.62 U3.14
  Bottom 0.152: v13.57,37.62 12.82,38.37 12.82,49.42 v7.86,54.38 5.25,54.38 P7.P$1
P0.29/AIN5  (via drill 0.35)
  Top 0.152: J1.2 9.98,56.38 v7.8,56.38 | v13.57,42.11 U3.9
  Bottom 0.152: v13.57,42.11 13.57,50.61 v7.8,56.38 5.18,56.38 P6.P$1
P1.00/USER_KEY  (via drill 0.35)
  Top 0.152: K2.2 37.15,4.06 41.09,4.06 43.27,6.24 43.27,31.13 43.46,31.32 43.46,45.65 v42.19,46.92 | v34.88,44.86 33.93,43.91 U3.48
  Top 0.5: R6.1 36.08,5.16 K2.2
  Bottom 0.152: v34.88,44.86 34.9,44.87 34.91,44.87 36.45,46.41 41.28,46.41 41.79,46.92 v42.19,46.92
P1.01/QSPI_IO2
  Top 0.152: U4.3 25.61,53.68 26.61,53.68 27.21,53.07 U3.60
P1.02/QSPI_IO0
  Top 0.152: U4.5 29.49,52.96 29.01,52.48 U3.58
P1.03/QSPI_IO1
  Top 0.152: U4.2 25.3,54.56 24.85,54.1 24.85,52.71 26.32,51.24 U3.61
P1.04/QSPI_SCK
  Top 0.152: U4.6 29.88,53.76 30.18,53.45 30.18,52 29.91,51.73 U3.57
P1.05/QSPI_CS
  Top 0.152: U4.1 25.34,55.36 24.53,54.54 24.53,52.37 25.41,51.48 U3.62
P1.08
  Top 0.152: U3.20 17.32,30.3 R11.1
P1.09/LED  (via drill 0.35)
  Top 0.152: LED2.- 10.39,3.77 v10.39,6.68 | U3.34 29.91,30.99 30.3,30.6 31.08,30.6 v31.18,30.51
  Bottom 0.152: v10.39,6.68 10.39,12.22 20.22,22.05 23.95,22.05 31.27,29.36 31.27,30.42 v31.18,30.51
RF_GPS
  Top 0.463: ANT3.P$1 18.02,66.72 arc-45 19.78,66 20.53,65.25 arc-45 L7.2 C53.1 20.9,63.35
SWDCLK  (via drill 0.35)
  Top 0.152: U3.51 34.8,46.61 35.44,47.25 38.46,47.25 38.62,47.09 v38.84,47.09
  Bottom 0.152: J8.P$4 45.08,63.6 45.08,53.33 v38.84,47.1 v38.84,47.09
SWDIO  (via drill 0.35)
  Top 0.152: v35.81,46.63 35.8,46.64 34.87,45.71 U3.50
  Bottom 0.152: J8.P$3 44.77,53.96 37.65,46.84 36.02,46.84 v35.81,46.63
VBUS  (via drill 0.35)
  Top 0.152: J3.B4 J3.A9 29.07,7.08 | 24.27,7.38 J3.B9 J3.A4 24.27,7.08
  Top 0.5: D1.+ 23.33,13.52 v24.04,14.23 | v33.32,32.53 U3.37
  Top 0.55: 29.07,6.33 29.07,6.28 27.65,4.85 25.69,4.85 24.27,6.28
  Top 0.6: 24.27,6.28 24.27,7.08 | 29.07,7.08 29.07,6.33 | 24.27,7.38 24.27,8.67
  Bottom 0.5: v24.04,14.23 24.04,16.09 25.3,17.35 25.3,22.23 33.32,30.25 v33.32,32.53
  pour Top: 19.56,13.88 19.56,11.35 22.58,8.33 24.49,8.33 24.49,9.21 23.6,10.1 23.6,14.35 22.06,14.35 21.59,13.88
VDD_NRF
  Top 0.5: 23.44,31.12 23.44,31.34 | U3.27 23.61,31.52 23.44,31.34 | U3.28 24.52,31.55 24.18,31.22 23.56,31.22 23.44,31.34
  Top 0.8: FB1.1 23.46,27.23 C1.1 C2.1 C10.1 23.44,31.12
VDD_RADIO
  Top 0.5: 19.11,31.08 U3.22 | U3.21 18.21,31.7 19.11,30.8
  Top 0.8: FB2.1 19.15,27.31 C3.1 19.12,28.05 | 19.12,28.05 | 19.12,28.05 19.12,28.53 C12.1 C4.1 19.11,30.8 19.11,31.08
VIN
  Top 0.5: U1.4 28.97,18.39 30.64,16.72 U1.1
  pour Top: 24.5,15.98 24.5,14.82 25.19,14.13 25.19,12.89 26.94,12.89 27.71,13.66 27.71,14.7 28.82,14.7 29.1,14.42 30.65,14.42 31.93,15.7 31.93,16.97 31.83,17.07 30.99,17.07 29.9,15.98

### Text on the board
tPlace: GND | 22 | 24 | 3V3 | 3V3 | 29 | 28 | GND | GND | 14 | 13 | 3V3 | 3V3 | 5 | 4 | GND | GND | 14 | 13 | 3V3 | 3V3 | 27 | 26 | GND | GND | 7 | 6 | 3V3 | 3V3 | 8 | 12 | GND | + | -
bPlace: GND | SWDCLK | 3V3 | SWDIO | Transceiver Module Dev Board / (with MCU)_V1.0
tNames: ANT4 | ANT3 | ANT2 | ANT5 | ANT1